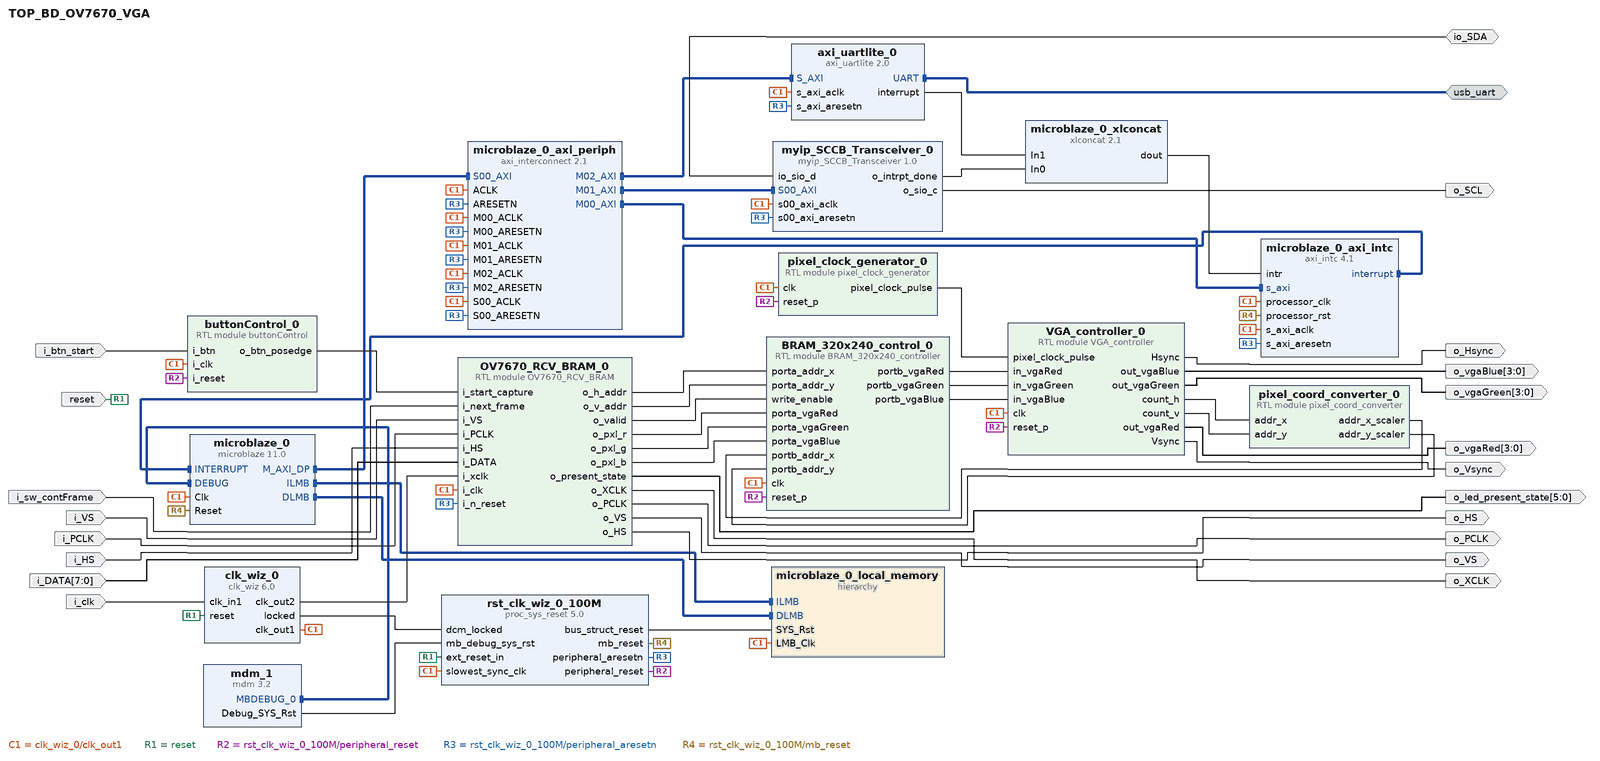
[diagram p0: block diagram of the top level]
# Vivado block design TOP_BD_OV7670_VGA, xc7a35tcpg236-1, Vivado 2019.2
create_bd_design TOP_BD_OV7670_VGA

create_bd_intf_port -mode Master -vlnv xilinx.com:interface:uart_rtl:1.0 usb_uart
create_bd_port -dir I i_btn_start
create_bd_port -dir I i_sw_contFrame
create_bd_port -dir I -type clk i_clk
set_property -dict {CONFIG.FREQ_HZ 100000000 CONFIG.PHASE 0.000} [get_bd_ports i_clk]
create_bd_port -dir I -type rst reset
set_property -dict {CONFIG.POLARITY ACTIVE_HIGH} [get_bd_ports reset]
create_bd_port -dir O -from 3 -to 0 o_vgaBlue
create_bd_port -dir O -from 3 -to 0 o_vgaGreen
create_bd_port -dir O -from 3 -to 0 o_vgaRed
create_bd_port -dir O o_Hsync
create_bd_port -dir O o_Vsync
create_bd_port -dir O o_XCLK
create_bd_port -dir I i_VS
create_bd_port -dir I i_PCLK
create_bd_port -dir I i_HS
create_bd_port -dir I -from 7 -to 0 i_DATA
create_bd_port -dir O -from 5 -to 0 o_led_present_state
create_bd_port -dir O o_SCL
create_bd_port -dir IO io_SDA
create_bd_port -dir O o_PCLK
create_bd_port -dir O o_VS
create_bd_port -dir O o_HS

create_bd_cell -type ip -vlnv xilinx.com:ip:clk_wiz:6.0 clk_wiz_0
set_property -dict [list \
  CONFIG.CLKOUT1_JITTER 130.958 \
  CONFIG.CLKOUT1_PHASE_ERROR 98.575 \
  CONFIG.CLKOUT2_JITTER 175.402 \
  CONFIG.CLKOUT2_PHASE_ERROR 98.575 \
  CONFIG.CLKOUT2_REQUESTED_OUT_FREQ 25.000 \
  CONFIG.CLKOUT2_USED true \
  CONFIG.CLK_IN1_BOARD_INTERFACE sys_clock \
  CONFIG.MMCM_CLKFBOUT_MULT_F 10.000 \
  CONFIG.MMCM_CLKIN1_PERIOD 10.000 \
  CONFIG.MMCM_CLKIN2_PERIOD 10.000 \
  CONFIG.MMCM_CLKOUT0_DIVIDE_F 10.000 \
  CONFIG.MMCM_CLKOUT1_DIVIDE 40 \
  CONFIG.NUM_OUT_CLKS 2 \
  CONFIG.RESET_BOARD_INTERFACE reset \
  CONFIG.USE_BOARD_FLOW true \
] [get_bd_cells clk_wiz_0]
create_bd_cell -type ip -vlnv xilinx.com:ip:proc_sys_reset:5.0 rst_clk_wiz_0_100M
create_bd_cell -type module -reference buttonControl buttonControl_0
create_bd_cell -type module -reference VGA_controller VGA_controller_0
create_bd_cell -type module -reference pixel_clock_generator pixel_clock_generator_0
create_bd_cell -type module -reference pixel_coord_converter pixel_coord_converter_0
create_bd_cell -type module -reference BRAM_320x240_controller BRAM_320x240_control_0
create_bd_cell -type ip -vlnv xilinx.com:ip:microblaze:11.0 microblaze_0
set_property -dict [list \
  CONFIG.C_DEBUG_ENABLED 1 \
  CONFIG.C_D_AXI 1 \
  CONFIG.C_D_LMB 1 \
  CONFIG.C_I_LMB 1 \
  CONFIG.G_TEMPLATE_LIST 8 \
  CONFIG.G_USE_EXCEPTIONS 1 \
] [get_bd_cells microblaze_0]
create_bd_cell -type hier microblaze_0_local_memory
create_bd_cell -type ip -vlnv xilinx.com:ip:axi_interconnect:2.1 microblaze_0_axi_periph
set_property -dict {CONFIG.NUM_MI 3} [get_bd_cells microblaze_0_axi_periph]
create_bd_cell -type ip -vlnv xilinx.com:ip:axi_intc:4.1 microblaze_0_axi_intc
set_property -dict {CONFIG.C_HAS_FAST 1} [get_bd_cells microblaze_0_axi_intc]
create_bd_cell -type ip -vlnv xilinx.com:ip:xlconcat:2.1 microblaze_0_xlconcat
create_bd_cell -type ip -vlnv xilinx.com:ip:mdm:3.2 mdm_1
create_bd_cell -type ip -vlnv xilinx.com:ip:axi_uartlite:2.0 axi_uartlite_0
set_property -dict {CONFIG.UARTLITE_BOARD_INTERFACE usb_uart CONFIG.USE_BOARD_FLOW true} [get_bd_cells axi_uartlite_0]
create_bd_cell -type module -reference OV7670_RCV_BRAM OV7670_RCV_BRAM_0
create_bd_cell -type ip -vlnv xilinx.com:user:myip_SCCB_Transceiver:1.0 myip_SCCB_Transceiver_0

# ---- hierarchy /microblaze_0_local_memory ----
current_bd_instance /microblaze_0_local_memory
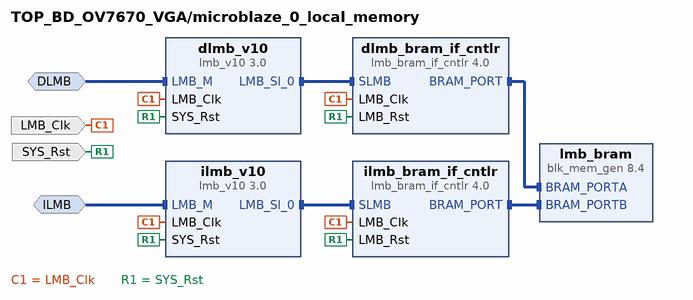
[diagram p1: block diagram inside /microblaze_0_local_memory]
create_bd_intf_pin -mode MirroredMaster -vlnv xilinx.com:interface:lmb_rtl:1.0 DLMB
create_bd_intf_pin -mode MirroredMaster -vlnv xilinx.com:interface:lmb_rtl:1.0 ILMB
create_bd_pin -dir I -type clk LMB_Clk
create_bd_pin -dir I -type rst SYS_Rst

create_bd_cell -type ip -vlnv xilinx.com:ip:lmb_v10:3.0 dlmb_v10
create_bd_cell -type ip -vlnv xilinx.com:ip:lmb_v10:3.0 ilmb_v10
create_bd_cell -type ip -vlnv xilinx.com:ip:lmb_bram_if_cntlr:4.0 dlmb_bram_if_cntlr
set_property -dict {CONFIG.C_ECC 0} [get_bd_cells dlmb_bram_if_cntlr]
create_bd_cell -type ip -vlnv xilinx.com:ip:lmb_bram_if_cntlr:4.0 ilmb_bram_if_cntlr
set_property -dict {CONFIG.C_ECC 0} [get_bd_cells ilmb_bram_if_cntlr]
create_bd_cell -type ip -vlnv xilinx.com:ip:blk_mem_gen:8.4 lmb_bram
set_property -dict {CONFIG.Memory_Type True_Dual_Port_RAM CONFIG.use_bram_block BRAM_Controller} [get_bd_cells lmb_bram]

# ---- connections ----

current_bd_instance /microblaze_0_local_memory
connect_bd_intf_net -intf_net microblaze_0_ilmb [get_bd_intf_pins ILMB] [get_bd_intf_pins ilmb_v10/LMB_M]
connect_bd_intf_net -intf_net microblaze_0_ilmb_cntlr [get_bd_intf_pins ilmb_bram_if_cntlr/BRAM_PORT] [get_bd_intf_pins lmb_bram/BRAM_PORTB]
connect_bd_intf_net -intf_net microblaze_0_dlmb_cntlr [get_bd_intf_pins dlmb_bram_if_cntlr/BRAM_PORT] [get_bd_intf_pins lmb_bram/BRAM_PORTA]
connect_bd_intf_net -intf_net microblaze_0_ilmb_bus [get_bd_intf_pins ilmb_v10/LMB_Sl_0] [get_bd_intf_pins ilmb_bram_if_cntlr/SLMB]
connect_bd_intf_net -intf_net microblaze_0_dlmb_bus [get_bd_intf_pins dlmb_v10/LMB_Sl_0] [get_bd_intf_pins dlmb_bram_if_cntlr/SLMB]
connect_bd_intf_net -intf_net microblaze_0_dlmb [get_bd_intf_pins DLMB] [get_bd_intf_pins dlmb_v10/LMB_M]
connect_bd_net -net microblaze_0_Clk [get_bd_pins LMB_Clk] \
  [get_bd_pins dlmb_v10/LMB_Clk] [get_bd_pins dlmb_bram_if_cntlr/LMB_Clk] [get_bd_pins ilmb_v10/LMB_Clk] \
  [get_bd_pins ilmb_bram_if_cntlr/LMB_Clk]
connect_bd_net [get_bd_pins SYS_Rst] \
  [get_bd_pins dlmb_v10/SYS_Rst] [get_bd_pins dlmb_bram_if_cntlr/LMB_Rst] [get_bd_pins ilmb_v10/SYS_Rst] \
  [get_bd_pins ilmb_bram_if_cntlr/LMB_Rst]
set_property HDL_ATTRIBUTE.BMM_INFO_ADDRESS_SPACE {byte  0x00000000 32 > TOP_BD_OV7670_VGA microblaze_0_local_memory/lmb_bram} [get_bd_cells dlmb_bram_if_cntlr]
set_property HDL_ATTRIBUTE.KEEP_HIERARCHY yes [get_bd_cells dlmb_bram_if_cntlr]

current_bd_instance /
connect_bd_intf_net [get_bd_intf_pins microblaze_0_axi_intc/interrupt] [get_bd_intf_pins microblaze_0/INTERRUPT]
connect_bd_intf_net [get_bd_intf_pins microblaze_0_axi_periph/M01_AXI] [get_bd_intf_pins myip_SCCB_Transceiver_0/S00_AXI]
connect_bd_intf_net [get_bd_intf_pins microblaze_0_axi_periph/M02_AXI] [get_bd_intf_pins axi_uartlite_0/S_AXI]
connect_bd_intf_net [get_bd_intf_pins microblaze_0/ILMB] [get_bd_intf_pins microblaze_0_local_memory/ILMB]
connect_bd_intf_net [get_bd_intf_ports usb_uart] [get_bd_intf_pins axi_uartlite_0/UART]
connect_bd_intf_net -intf_net microblaze_0_intc_axi [get_bd_intf_pins microblaze_0_axi_periph/M00_AXI] [get_bd_intf_pins microblaze_0_axi_intc/s_axi]
connect_bd_intf_net -intf_net microblaze_0_axi_dp [get_bd_intf_pins microblaze_0_axi_periph/S00_AXI] [get_bd_intf_pins microblaze_0/M_AXI_DP]
connect_bd_intf_net [get_bd_intf_pins microblaze_0/DLMB] [get_bd_intf_pins microblaze_0_local_memory/DLMB]
connect_bd_intf_net [get_bd_intf_pins mdm_1/MBDEBUG_0] [get_bd_intf_pins microblaze_0/DEBUG]
connect_bd_net -net i_btn_0_1 [get_bd_ports i_btn_start] [get_bd_pins buttonControl_0/i_btn]
connect_bd_net -net i_next_frame_0_1 [get_bd_ports i_sw_contFrame] [get_bd_pins OV7670_RCV_BRAM_0/i_next_frame]
connect_bd_net [get_bd_pins buttonControl_0/o_btn_posedge] [get_bd_pins OV7670_RCV_BRAM_0/i_start_capture]
connect_bd_net -net sys_clock_1 [get_bd_ports i_clk] [get_bd_pins clk_wiz_0/clk_in1]
connect_bd_net -net microblaze_0_Clk [get_bd_pins clk_wiz_0/clk_out1] \
  [get_bd_pins rst_clk_wiz_0_100M/slowest_sync_clk] [get_bd_pins buttonControl_0/i_clk] [get_bd_pins VGA_controller_0/clk] \
  [get_bd_pins pixel_clock_generator_0/clk] [get_bd_pins BRAM_320x240_control_0/clk] [get_bd_pins microblaze_0/Clk] \
  [get_bd_pins microblaze_0_axi_periph/ACLK] [get_bd_pins microblaze_0_axi_periph/S00_ACLK] \
  [get_bd_pins microblaze_0_axi_periph/M00_ACLK] [get_bd_pins microblaze_0_axi_intc/s_axi_aclk] \
  [get_bd_pins microblaze_0_axi_intc/processor_clk] [get_bd_pins microblaze_0_local_memory/LMB_Clk] \
  [get_bd_pins microblaze_0_axi_periph/M01_ACLK] [get_bd_pins axi_uartlite_0/s_axi_aclk] \
  [get_bd_pins microblaze_0_axi_periph/M02_ACLK] [get_bd_pins OV7670_RCV_BRAM_0/i_clk] \
  [get_bd_pins myip_SCCB_Transceiver_0/s00_axi_aclk]
connect_bd_net [get_bd_pins clk_wiz_0/locked] [get_bd_pins rst_clk_wiz_0_100M/dcm_locked]
connect_bd_net [get_bd_ports reset] [get_bd_pins clk_wiz_0/reset] [get_bd_pins rst_clk_wiz_0_100M/ext_reset_in]
connect_bd_net [get_bd_pins OV7670_RCV_BRAM_0/o_h_addr] [get_bd_pins BRAM_320x240_control_0/porta_addr_x]
connect_bd_net [get_bd_pins OV7670_RCV_BRAM_0/o_v_addr] [get_bd_pins BRAM_320x240_control_0/porta_addr_y]
connect_bd_net [get_bd_pins OV7670_RCV_BRAM_0/o_valid] [get_bd_pins BRAM_320x240_control_0/write_enable]
connect_bd_net [get_bd_pins OV7670_RCV_BRAM_0/o_pxl_r] [get_bd_pins BRAM_320x240_control_0/porta_vgaRed]
connect_bd_net [get_bd_pins OV7670_RCV_BRAM_0/o_pxl_g] [get_bd_pins BRAM_320x240_control_0/porta_vgaGreen]
connect_bd_net [get_bd_pins OV7670_RCV_BRAM_0/o_pxl_b] [get_bd_pins BRAM_320x240_control_0/porta_vgaBlue]
connect_bd_net [get_bd_pins pixel_clock_generator_0/pixel_clock_pulse] [get_bd_pins VGA_controller_0/pixel_clock_pulse]
connect_bd_net [get_bd_pins BRAM_320x240_control_0/portb_vgaRed] [get_bd_pins VGA_controller_0/in_vgaRed]
connect_bd_net [get_bd_pins BRAM_320x240_control_0/portb_vgaGreen] [get_bd_pins VGA_controller_0/in_vgaGreen]
connect_bd_net [get_bd_pins BRAM_320x240_control_0/portb_vgaBlue] [get_bd_pins VGA_controller_0/in_vgaBlue]
connect_bd_net [get_bd_pins VGA_controller_0/out_vgaBlue] [get_bd_ports o_vgaBlue]
connect_bd_net [get_bd_pins VGA_controller_0/out_vgaGreen] [get_bd_ports o_vgaGreen]
connect_bd_net [get_bd_pins VGA_controller_0/out_vgaRed] [get_bd_ports o_vgaRed]
connect_bd_net [get_bd_pins VGA_controller_0/Hsync] [get_bd_ports o_Hsync]
connect_bd_net [get_bd_pins VGA_controller_0/Vsync] [get_bd_ports o_Vsync]
connect_bd_net -net i_VS_0_1 [get_bd_ports i_VS] [get_bd_pins OV7670_RCV_BRAM_0/i_VS]
connect_bd_net -net i_PCLK_0_1 [get_bd_ports i_PCLK] [get_bd_pins OV7670_RCV_BRAM_0/i_PCLK]
connect_bd_net -net i_HS_0_1 [get_bd_ports i_HS] [get_bd_pins OV7670_RCV_BRAM_0/i_HS]
connect_bd_net -net i_DATA_0_1 [get_bd_ports i_DATA] [get_bd_pins OV7670_RCV_BRAM_0/i_DATA]
connect_bd_net [get_bd_pins OV7670_RCV_BRAM_0/o_present_state] [get_bd_ports o_led_present_state]
connect_bd_net [get_bd_pins rst_clk_wiz_0_100M/peripheral_reset] \
  [get_bd_pins buttonControl_0/i_reset] [get_bd_pins VGA_controller_0/reset_p] [get_bd_pins pixel_clock_generator_0/reset_p] \
  [get_bd_pins BRAM_320x240_control_0/reset_p]
connect_bd_net [get_bd_pins rst_clk_wiz_0_100M/peripheral_aresetn] \
  [get_bd_pins microblaze_0_axi_periph/ARESETN] [get_bd_pins microblaze_0_axi_periph/S00_ARESETN] \
  [get_bd_pins microblaze_0_axi_periph/M00_ARESETN] [get_bd_pins microblaze_0_axi_intc/s_axi_aresetn] \
  [get_bd_pins microblaze_0_axi_periph/M01_ARESETN] [get_bd_pins axi_uartlite_0/s_axi_aresetn] \
  [get_bd_pins microblaze_0_axi_periph/M02_ARESETN] [get_bd_pins OV7670_RCV_BRAM_0/i_n_reset] \
  [get_bd_pins myip_SCCB_Transceiver_0/s00_axi_aresetn]
connect_bd_net [get_bd_pins OV7670_RCV_BRAM_0/o_XCLK] [get_bd_ports o_XCLK]
connect_bd_net [get_bd_pins VGA_controller_0/count_h] [get_bd_pins pixel_coord_converter_0/addr_x]
connect_bd_net [get_bd_pins VGA_controller_0/count_v] [get_bd_pins pixel_coord_converter_0/addr_y]
connect_bd_net [get_bd_pins pixel_coord_converter_0/addr_x_scaler] [get_bd_pins BRAM_320x240_control_0/portb_addr_x]
connect_bd_net [get_bd_pins pixel_coord_converter_0/addr_y_scaler] [get_bd_pins BRAM_320x240_control_0/portb_addr_y]
connect_bd_net [get_bd_pins clk_wiz_0/clk_out2] [get_bd_pins OV7670_RCV_BRAM_0/i_xclk]
connect_bd_net -net microblaze_0_intr [get_bd_pins microblaze_0_xlconcat/dout] [get_bd_pins microblaze_0_axi_intc/intr]
connect_bd_net [get_bd_pins rst_clk_wiz_0_100M/mb_reset] [get_bd_pins microblaze_0/Reset] [get_bd_pins microblaze_0_axi_intc/processor_rst]
connect_bd_net [get_bd_pins rst_clk_wiz_0_100M/bus_struct_reset] [get_bd_pins microblaze_0_local_memory/SYS_Rst]
connect_bd_net [get_bd_pins mdm_1/Debug_SYS_Rst] [get_bd_pins rst_clk_wiz_0_100M/mb_debug_sys_rst]
connect_bd_net [get_bd_pins axi_uartlite_0/interrupt] [get_bd_pins microblaze_0_xlconcat/In1]
connect_bd_net [get_bd_pins myip_SCCB_Transceiver_0/o_intrpt_done] [get_bd_pins microblaze_0_xlconcat/In0]
connect_bd_net [get_bd_pins myip_SCCB_Transceiver_0/o_sio_c] [get_bd_ports o_SCL]
connect_bd_net [get_bd_ports io_SDA] [get_bd_pins myip_SCCB_Transceiver_0/io_sio_d]
connect_bd_net [get_bd_pins OV7670_RCV_BRAM_0/o_PCLK] [get_bd_ports o_PCLK]
connect_bd_net [get_bd_pins OV7670_RCV_BRAM_0/o_VS] [get_bd_ports o_VS]
connect_bd_net [get_bd_pins OV7670_RCV_BRAM_0/o_HS] [get_bd_ports o_HS]
set_property HDL_ATTRIBUTE.BMM_INFO_PROCESSOR {microblaze-le > TOP_BD_OV7670_VGA microblaze_0_local_memory/dlmb_bram_if_cntlr} [get_bd_cells microblaze_0]
set_property HDL_ATTRIBUTE.KEEP_HIERARCHY yes [get_bd_cells microblaze_0]

# ---- address map ----
assign_bd_address -offset 0x00000000 -range 16K -target_address_space [get_bd_addr_spaces microblaze_0/Data] [get_bd_addr_segs microblaze_0_local_memory/dlmb_bram_if_cntlr/SLMB/Mem]
assign_bd_address -offset 0x40600000 -range 64K -target_address_space [get_bd_addr_spaces microblaze_0/Data] [get_bd_addr_segs axi_uartlite_0/S_AXI/Reg]
assign_bd_address -offset 0x41200000 -range 64K -target_address_space [get_bd_addr_spaces microblaze_0/Data] [get_bd_addr_segs microblaze_0_axi_intc/S_AXI/Reg]
assign_bd_address -offset 0x44A00000 -range 64K -target_address_space [get_bd_addr_spaces microblaze_0/Data] [get_bd_addr_segs myip_SCCB_Transceiver_0/S00_AXI/S00_AXI_reg]
assign_bd_address -offset 0x00000000 -range 16K -target_address_space [get_bd_addr_spaces microblaze_0/Instruction] [get_bd_addr_segs microblaze_0_local_memory/ilmb_bram_if_cntlr/SLMB/Mem]

validate_bd_design
save_bd_design
